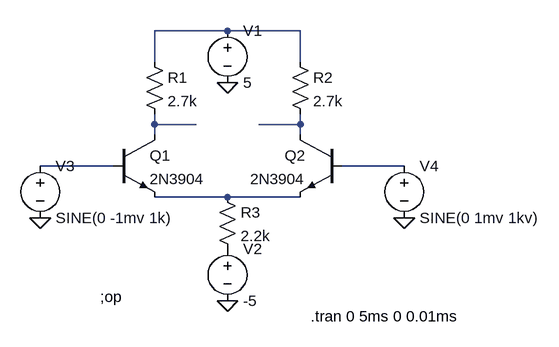
[diagram p0: schematic Az2.asc]
Az2.asc, the LTspice schematic file:
Version 4
SHEET 1 880 680
WIRE 208 -64 96 -64
WIRE 320 -64 208 -64
WIRE 96 -16 96 -64
WIRE 320 -16 320 -64
WIRE 96 80 96 64
WIRE 160 80 96 80
WIRE 320 80 320 64
WIRE 320 80 256 80
WIRE 96 96 96 80
WIRE 320 96 320 80
WIRE 32 144 -80 144
WIRE 480 144 384 144
WIRE 208 192 96 192
WIRE 320 192 208 192
FLAG 208 16 0
FLAG 208 352 0
FLAG 480 224 0
FLAG -80 224 0
SYMBOL npn 32 96 R0
SYMATTR InstName Q1
SYMATTR Value 2N3904
SYMBOL npn 384 96 M0
SYMATTR InstName Q2
SYMATTR Value 2N3904
SYMBOL res 80 -32 R0
SYMATTR InstName R1
SYMATTR Value 2.7k
SYMBOL res 304 -32 R0
SYMATTR InstName R2
SYMATTR Value 2.7k
SYMBOL res 192 176 R0
SYMATTR InstName R3
SYMATTR Value 2.2k
SYMBOL voltage 208 -80 R0
SYMATTR InstName V1
SYMATTR Value 5
SYMBOL voltage 208 256 R0
SYMATTR InstName V2
SYMATTR Value -5
SYMBOL voltage -80 128 R0
WINDOW 123 0 0 Left 0
WINDOW 39 0 0 Left 0
SYMATTR InstName V3
SYMATTR Value SINE(0 -1mv 1k)
SYMBOL voltage 480 128 R0
WINDOW 123 0 0 Left 0
WINDOW 39 0 0 Left 0
SYMATTR InstName V4
SYMATTR Value SINE(0 1mv 1kv)
TEXT 12 346 Left 2 !;op
TEXT 336 376 Left 2 !.tran 0 5ms 0 0.01ms

The netlist it stands for:
* Az2.asc
Q1 N002 N004 N006 0 2N3904
Q2 N003 N005 N006 0 2N3904
R1 N001 N002 2.7k
R2 N001 N003 2.7k
R3 N006 P001 2.2k
V1 N001 0 5
V2 P001 0 -5
V3 N004 0 SINE(0 -1mv 1k)
V4 N005 0 SINE(0 1mv 1kv)
.model NPN NPN
.model PNP PNP
.lib standard.bjt
;op
.tran 0 5ms 0 0.01ms
.backanno
.end